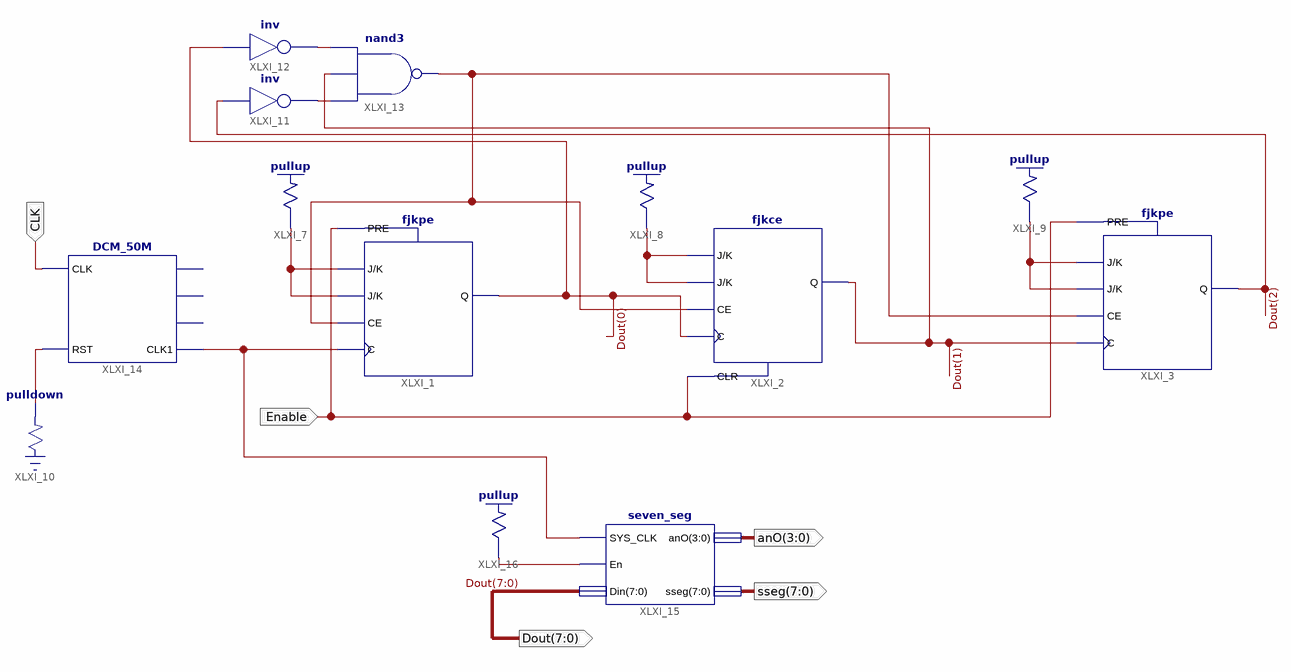
[diagram p0: schematic sheet 1]
// Xilinx ISE schematic Exp4.sch (spartan3e) as structural Verilog: 13 symbols, 5 ports
module Exp4 (
  input  CLK,
  input  Enable,
  output [7:0] Dout,
  output [3:0] anO,
  output [7:0] sseg
);

  wire XLXN_5, XLXN_6, XLXN_7, XLXN_8, XLXN_9, XLXN_13, XLXN_14, XLXN_18, XLXN_20;

  fjkpe XLXI_1 (.C(XLXN_5), .CE(XLXN_9), .J(XLXN_6), .K(XLXN_6), .PRE(Enable), .Q(Dout[0]));
  fjkce XLXI_2 (.C(Dout[0]), .CE(XLXN_9), .CLR(Enable), .J(XLXN_7), .K(XLXN_7), .Q(Dout[1]));
  fjkpe XLXI_3 (.C(Dout[1]), .CE(XLXN_9), .J(XLXN_8), .K(XLXN_8), .PRE(Enable), .Q(Dout[2]));
  \pullup  XLXI_7 (.O(XLXN_6));
  \pullup  XLXI_8 (.O(XLXN_7));
  \pullup  XLXI_9 (.O(XLXN_8));
  \pulldown  XLXI_10 (.O(XLXN_18));
  not XLXI_11 (XLXN_13, Dout[2]);
  not XLXI_12 (XLXN_14, Dout[0]);
  nand XLXI_13 (XLXN_9, XLXN_13, Dout[1], XLXN_14);
  DCM_50M XLXI_14 (.CLK(CLK), .RST(XLXN_18), .CLK1(XLXN_5));  // open: CLK1M, CLK10k, CLK1k
  seven_seg XLXI_15 (.SYS_CLK(XLXN_5), .En(XLXN_20), .Din(Dout), .anO(anO), .sseg(sseg));
  \pullup  XLXI_16 (.O(XLXN_20));
endmodule
